# Altium schematic sheet Circuit Schemativ 1.SchDoc
size A4; SheetNumber: 1; SheetTotal: 1
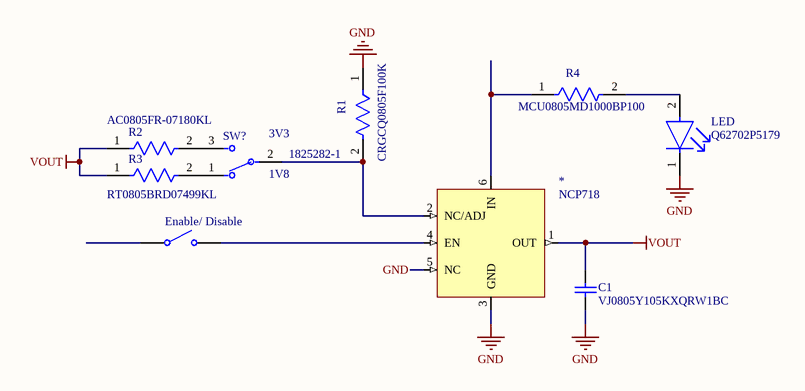
[diagram p0: Circuit Schemativ 1.SchDoc]

## Parts
*  NCP718  [NCP718]
C1  VJ0805Y105KXQRW1BC  [CAPC2013X145X50NL20T20]
Enable/_Disable  Single-Pole, Single-Throw Switch  (value not drawn)
LED  Q62702P5179  [FP-LG_R971-MFG]
R1  CRGCQ0805F100K  [FP-CRGCQ0805-IPC_C]
R2  AC0805FR-07180KL  [FP-AC0805-MFG]
R3  RT0805BRD07499KL  [FP-RT0805-MFG]
R4  MCU0805MD1000BP100  [FP-MCU0805-IPC_A]
SW?  1825282-1  [FP-1825282-1-MFG]

## Nets
GND: *.3(GND) *.5(NC) C1.1 LED.1(C) R1.1
VOUT: *.1(OUT) C1.2 R2.1 R3.1
Net*_2: *.2(NC/ADJ) R1.2 SW?.2
Net*_4: *.4(EN) Enable/_Disable.2
Net*_6: *.6(IN) R4.1
NetLED_2: LED.2(A) R4.2
NetR2_2: R2.2 SW?.3
NetR3_2: R3.2 SW?.1

Not connected (* = marked no-connect by the designer): Enable/_Disable 1

## Notes on the sheet
- (near SW?) 3V3
- (near SW?) 1V8

## Library data of the parts
C1 = CMP-2007-01676-1: Manufacturer: Vitramon; Part Number: VJ0805Y105KXQRW1BC
Enable/_Disable = SPST SW: closed: 0; Rclosed: 1m; Ropen: 1Meg; SimulationGenericComponent: True
LED = CMP-62016-000039-1: LED GREEN DIFFUSED 0805 SMD; Test Current: 20mA; Power Dissipation: 65mW; Number of LEDs: 1; Viewing Angle: 160°; Lens Color: White; Lens Size: 1.25mm; Forward Voltage: 2.2V; Reverse Voltage: 12V; Forward Current: 25mA; Luminous Intensity: 45mcd; Luminous Flux: 0.1lm; Dominant Wavelength: 570nm; Min Operating Temperature: -30°C; Packaging: Tape and Reel; Radiation Hardening: No; Number of Pins: 2; Case Code (Imperial): 0805; Lens Style: Diffused; Mount: Surface Mount; Package Quantity: 1; Case Code (Metric): 2012; Color: Green; Case/Package: 0805; Width: 1.25mm; Illumination Color: Green; Lens Transparency: Diffused; Max Operating Temperature: 85°C; Number of Elements: 1; Depth: 1.35mm; Height: 0.9mm; Length: 2.1mm
R1 = CMP-03211-000816-1: CRGCQ 0805 100K 1%; Manufacturer: TE Connectivity; Tolerance: 0.01; Power Rating: 0.125W; Resistance: 100KΩ; Value: 100KΩ; Temperature Coefficient: ±100ppm/°C; Voltage Rating: 150V; Description: CRGCQ0805 100KΩ 0.125W ±100ppm/°C 1% 150V; RoHS: TRUE; ComponentLink2URL: https://www.te.com/commerce/DocumentDelivery/DDEController?Action=showdoc&DocId=Data+Sheet%7F1773204-3%7F1%7Fpdf%7FEnglish%7FENG_DS_1773204-3_1.pdf%7F4-2176341-1150; Category: Res; Device Class L2: Resistors; Height: 0.65mm; Ambient Temperature Range High: +70°C; Ipc Land Pattern Name: RESC200125X55; Octopart: https://octopart.com/crgcq0805f100k-te+connectivity-91018138; Digikey Description: CRGCQ 0805 100K 1%; Temperature Range High: +155°C; Lead Free: Yes; Automotive: Yes; Temperature Range Low: -55°C; Device Class L1: Passive Components; Device Class L3: Chip SMD Resistors; Mouser Description: Res Thick Film 0805 100K Ohm 1% 0.125W(1/8W) ±100ppm/C Pad SMD Automotive T/R; Temperature: -55°C to +155°C; Composition: Thick Film; ComponentLink2Description: Datasheet; Automotive Grade: Grade 1141; Package: CRGCQ0805; Manufacturer Part Number: CRGCQ0805F100K; Series: CRGCQ
R2 = CMP-03412-037640-1: RES SMD 180K OHM 1% 1/8W 0805; Manufacturer: Yageo; Resistance: 180KΩ; Automotive Grade: Grade 0; Tolerance: 0.01; Voltage Rating: 150V; Value: 180KΩ; Category: Res; Digikey Description: RES SMD 180K OHM 1% 1/8W 0805; Temperature Range Low: -55°C; Automotive: Yes; Lead Free: Yes; Power Rating: 1/8W; Footprint Url: http://www.yageo.com/exep/pages/download/literatures/PYu-R_Mount_10.pdf; Device Class L2: Resistors; Device Class L1: Passive Components; Height: 0.6mm; ComponentLink2Description: Datasheet; ComponentLink2URL: http://www.yageo.com/documents/recent/PYu-AC_51_RoHS_L_6.pdf; Temperature: -55°C to +155°C; RoHS: TRUE; Octopart: https://octopart.com/ac0805fr-07180kl-yageo-26041139; Composition: Thick Film; Series: AC; Package: AC0805; Ipc Land Pattern Name: RESC200125X50; Manufacturer Part Number: AC0805FR-07180KL; Device Class L3: Chip SMD Resistors; Temperature Range High: +155°C
R3 = CMP-2001-01744-2: RES SMD 499K OHM 0.1% 1/8W 0805; Manufacturer: Yageo; Resistance: 499KΩ; Description: RT0805 499KΩ 0.125W 25 ppm/°C 0.25%; Tolerance: 0.0025; Value: 499KΩ; Power Rating: 0.125W; Voltage Rating: 150V; Temperature Coefficient: 25 ppm/°C; Device Class L1: Passive Components; Temperature Range High: +155°C; Package: RT0805; Octopart: https://octopart.com/rt0805brd07499kl-yageo-1259857; Temperature Range Low: -55°C; Temperature: -55°C to +155°C; Composition: Thin Film; Ipc Land Pattern Name: RESC200125X50; Device Class L2: Resistors; Series: RT; Lead Free: Yes; Footprint Url: http://www.yageo.com/exep/pages/download/literatures/PYu-R_Mount_10.pdf; Mouser Description: Thin Film Resistors - SMD 1/8W 499K ohm .1% 25ppm; Digikey Description: RES SMD 499K OHM 0.1% 1/8W 0805; Device Class L3: Chip SMD Resistors; ComponentLink2Description: Datasheet; ComponentLink2URL: http://www.yageo.com/documents/recent/PYu-RT_1-to-0.01_RoHS_L_9.pdf; Category: Res; Manufacturer Part Number: RT0805BRD07499KL; Height: 0.6mm; Automotive: No; RoHS: TRUE
R4 = CMP-02407-001292-1: RES 1.05K OHM 0.5% 1/5W 0805; Temperature Coefficient: 25ppm/°C; Resistance: 100R; Power Rating: 200mW; Tolerance: 0.1%; Voltage Rating: 150V; Packaging: Tape and Reel; Width: 0.049inch; Height: 0.024inch; Features: Automotive AEC-Q200; Weight: 0.000162oz; Max Operating Temperature: 155°C; Case Code (Metric): 2012; Case Code (Imperial): 0805; Composition: Thin Film; Package Quantity: 1; Number of Terminations: 2; Length: 0.079inch; Min Operating Temperature: -55°C; Max Power Dissipation: 200mW; Case/Package: 0805
SW? = CMP-03405-000011-1: SWITCH SLIDE SPDT 100MA 12V; Electrical Life: 10000Cycles; Operating Force: 250gf; Number of Positions: 2; Actuator Length: 2.5mm; Contact Style: Shorting; Tail Length: 0.118inch; Switch Function: On-On; Actuator Material: Nylon; Actuator Type: Standard; Switch Travel: 2mm; Housing Material: Nylon; Voltage Rating (DC): 12V; Termination: PC Pins; Max Current Rating: 100mA; Length: 10.2mm; Min Operating Temperature: -20°C; Radiation Hardening: No; Packaging: Tray; Throw Configuration: SPDT; Type: Switch; Current Rating: 100mA; ELV: Compliant; Mechanical Life: 10000Cycles; Mount: Through Hole; Flammability Rating: UL94 V-0; Width: 4.3mm; Series: SSJ, Alcoswitch; Max Operating Temperature: 70°C; Contact Current Rating: 100mA; RoHS Compliant: Yes; Depth: 6.8mm; Contact Plating: Silver; Package Quantity: 800; Max Voltage Rating (DC): 12V; Contact Material: Copper Alloy